# Altium schematic sheet Power.schdoc
size 252 x 201 mm
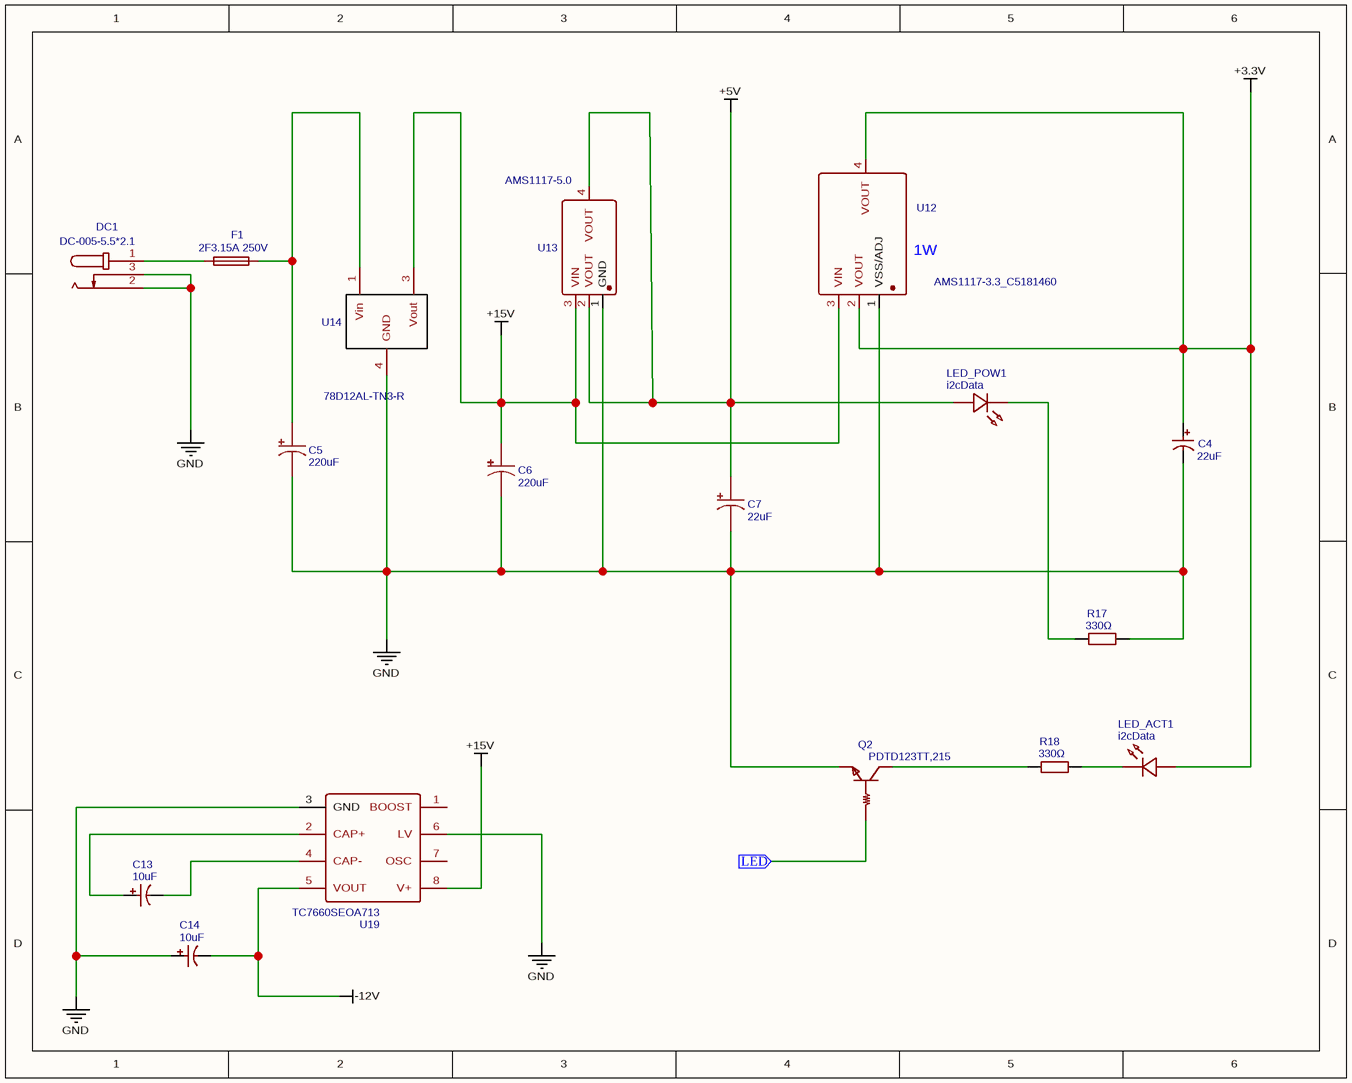
[diagram p0: Power.schdoc]

## Parts
C4  22uF  [CAP-SMD_BD4.0-L4.3-W4.3-LS5.1-FD]
C5  220uF  [CAP-SMD_BD10.0-L10.3-W10.3-LS11.3-FD]
C6  220uF  [CAP-SMD_BD10.0-L10.3-W10.3-LS11.3-FD]
C7  22uF  [CAP-SMD_BD5.0-L5.3-W5.3-FD]
C13  10uF  [CAP-TH_BD4.0-P1.50-D0.8-FD]
C14  10uF  [CAP-TH_BD4.0-P1.50-D0.8-FD]
DC1  DC-005-5.5*2.1  [DC-IN-TH_DC-005-2]
F1  2F3.15A 250V  [FUSE-TH_BD2.7-L7.3-P11.30-D0.6]
LED_ACT1  i2cData  [LED-TH_BD3.8-P2.54-RD]
LED_POW1  i2cData  [LED-TH_BD3.8-P2.54-RD]
Q2  PDTD123TT,215  [SOT-23-3_L2.9-W1.6-P1.90-LS2.8-BR]
R17  330Ω  [R0603]
R18  330Ω  [R0603]
U12  AMS1117-3.3_C5181460  [SOT-223-3_L6.4-W3.5-P2.30-LS7.0-BR]
U13  AMS1117-5.0  [SOT-223_L6.5-W3.5-P2.30-LS7.0-BR]
U14  78D12AL-TN3-R  [TO-252-2_L6.5-W6.1-P4.58-LS10.0-TL]
U19  TC7660SEOA713  [SOIC-8_L4.9-W3.9-P1.27-LS6.0-BL]

## Ports
LED (in)

## Nets
+3.3V: C4.1 LED_ACT1.2(A) U12.2(VOUT) U12.4(VOUT)
+5V: C7.1 LED_POW1.2(A) U13.2(VOUT) U13.4(VOUT)
+15V: C6.1 U12.3(VIN) U13.3(VIN) U14.3(Vout) U19.8(V+)
-12V: C14.2 U19.5(VOUT)
GND: C4.2 C5.2 C6.2 C7.2 C14.1 DC1.2 DC1.3 Q2.2(E) R17.2 U12.1(VSS/ADJ) U13.1(GND) U14.4(GND) U19.3(GND) U19.6(LV)
LED: Q2.1(B) ; port LED
NetC5_1: C5.1 F1.2 U14.1(Vin)
NetC13_1: C13.1 U19.2(CAP+)
NetC13_2: C13.2 U19.4(CAP-)
NetDC1_1: DC1.1 F1.1
NetLED_ACT1_1: LED_ACT1.1(K) R18.2
NetLED_POW1_1: LED_POW1.1(K) R17.1
NetQ2_3: Q2.3(C) R18.1

Not connected (* = marked no-connect by the designer): U19 1(BOOST) 7(OSC)

## Notes on the sheet
- (near U12) 1W

## Library data of the parts
C4 = 22uF: Manufacturer: ROQANG(容强); Manufacturer Part: RVE1C220M0405; nameAlias: Value; Supplier: LCSC; Supplier Part: C131114; JLCPCB Part Class: Extended Part; link: https://lcsc.com/eda_search?q=C131114&%26type=1&ref=editor; spicePre: C; spiceSymbolName: RVE1C220M0405
C5 C6 = 220uF: Manufacturer: Nichicon(尼吉康); Manufacturer Part: UWT1H221MNL1GS; nameAlias: Value; Contributor: LCSC; Supplier: LCSC; Supplier Part: C125977; JLCPCB Part Class: Extended Part; link: https://lcsc.com/eda_search?q=C125977&%26type=1&ref=editor; spicePre: C; spiceSymbolName: UWT1H221MNL1GS
C7 = 22uF: Manufacturer: ROQANG; Manufacturer Part: VT1E220M0505; nameAlias: Capacitance; Contributor: LCSC; Supplier: LCSC; Supplier Part: C239255; JLCPCB Part Class: Extended Part; spicePre: C; spiceSymbolName: VT1E220M0505
C13 C14 = 10uF: Manufacturer: CX(承兴); Manufacturer Part: KS106M025C07RR0VH2FP0; nameAlias: Value; Supplier: LCSC; Supplier Part: C43351; JLCPCB Part Class: Extended Part; spicePre: C; spiceSymbolName: 10uF 25V 4*7
DC1 = DC-005-5.5*2.1: Manufacturer: null; Contributor: lcsc; Supplier: LCSC; Supplier Part: C9900017044; Manufacturer Part: DC-005-5.5*2.1; JLCPCB Part Class: Extended Part; link: https://lcsc.com/eda_search?q=C9900017044&%26type=1&ref=editor; spicePre: D; spiceSymbolName: DC-005-5.5*2.1
F1 = 2F3.15A 250V: Manufacturer: xcfuse(旭程); Manufacturer Part: 2F.3150212000R1B02; Contributor: LCSC; Supplier: LCSC; Supplier Part: C140541; JLCPCB Part Class: Extended Part; link: https://lcsc.com/eda_search?q=C140541&%26type=1&ref=editor; spicePre: F; spiceSymbolName: 2F3.15A 250V
LED_ACT1 LED_POW1 = i2cData: Manufacturer: TUOZHAN(拓展光电); Manufacturer Part: TZ-L2-03YYBYG1GDJ30-001; Contributor: LCSC; Supplier: LCSC; Supplier Part: C779431; JLCPCB Part Class: Extended Part; spicePre: L; spiceSymbolName: TZ-L2-03YYBYG1GDJ30-001
Q2 = PDTD123TT,215: Manufacturer: Nexperia(安世); Contributor: LCSC; Supplier: LCSC; Manufacturer Part: PDTD123TT,215; Supplier Part: C168870; JLCPCB Part Class: Extended Part; link: https://lcsc.com/eda_search?q=C168870&%26type=1&ref=editor; spicePre: Q; spiceSymbolName: PDTD123TT,215
R17 R18 = 330Ω: Manufacturer: FH; Manufacturer Part: RS-03K331FT; Resistance (Ohms): 330; nameAlias: Resistance; Contributor: LCSC; Supplier: LCSC; Supplier Part: C125768; JLCPCB Part Class: Extended Part; spicePre: R; spiceSymbolName: RS-03K331FT
U12 = AMS1117-3.3_C5181460: Manufacturer: HX(恒佳兴); Contributor: lcsc; Supplier: LCSC; Supplier Part: C5181460; Manufacturer Part: AMS1117-3.3; JLCPCB Part Class: Extended Part; link: https://lcsc.com/eda_search?q=C5181460&%26type=1&ref=editor; spicePre: U; spiceSymbolName: AMS1117-3.3_C5181460
U13 = AMS1117-5.0: Manufacturer: AMS; sourceId: HltLFyQwq; timeStamp: 1466676067; Supplier: LCSC; Manufacturer Part: AMS1117-5.0; Supplier Part: C6187; JLCPCB Part Class: Basic Part; link: https://lcsc.com/eda_search?q=C6187&%26type=1&ref=editor; spicePre: U; spiceSymbolName: AMS1117-5.0
U14 = 78D12AL-TN3-R: Manufacturer: UTC(友顺); Supplier: LCSC; Manufacturer Part: 78D12AL-TN3-R; Supplier Part: C73290; JLCPCB Part Class: Extended Part; link: https://lcsc.com/eda_search?q=C73290&%26type=1&ref=editor; spicePre: U; spiceSymbolName: 78D12AL-TN3-R
U19 = TC7660SEOA713: Manufacturer: MICROCHIP(美国微芯); Contributor: LCSC; Supplier: LCSC; Manufacturer Part: TC7660SEOA713; Supplier Part: C144305; JLCPCB Part Class: Extended Part; spicePre: U; spiceSymbolName: TC7660SEOA713